# EAGLE schematic Octoprober (EAGLE 6.5.0)
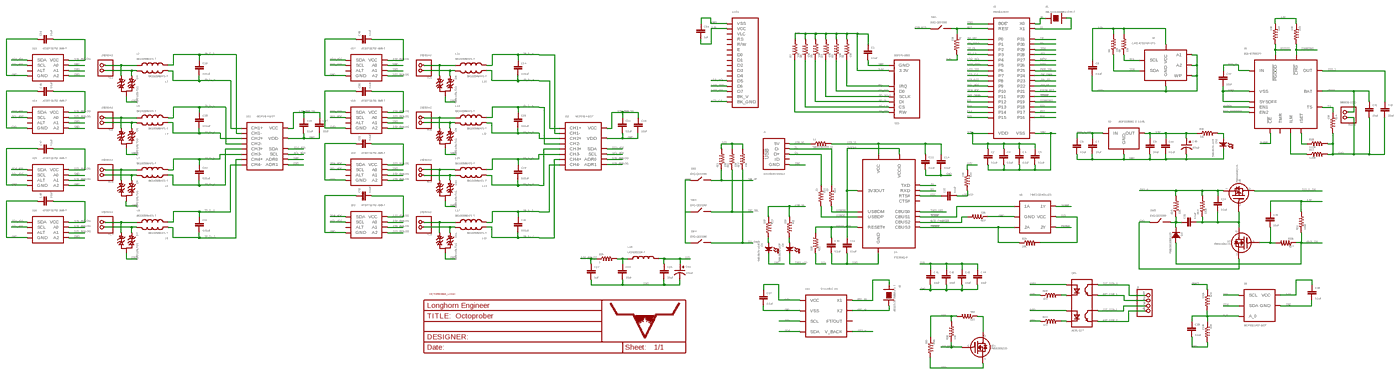
[diagram p0: schematic, sheet 1, overview]
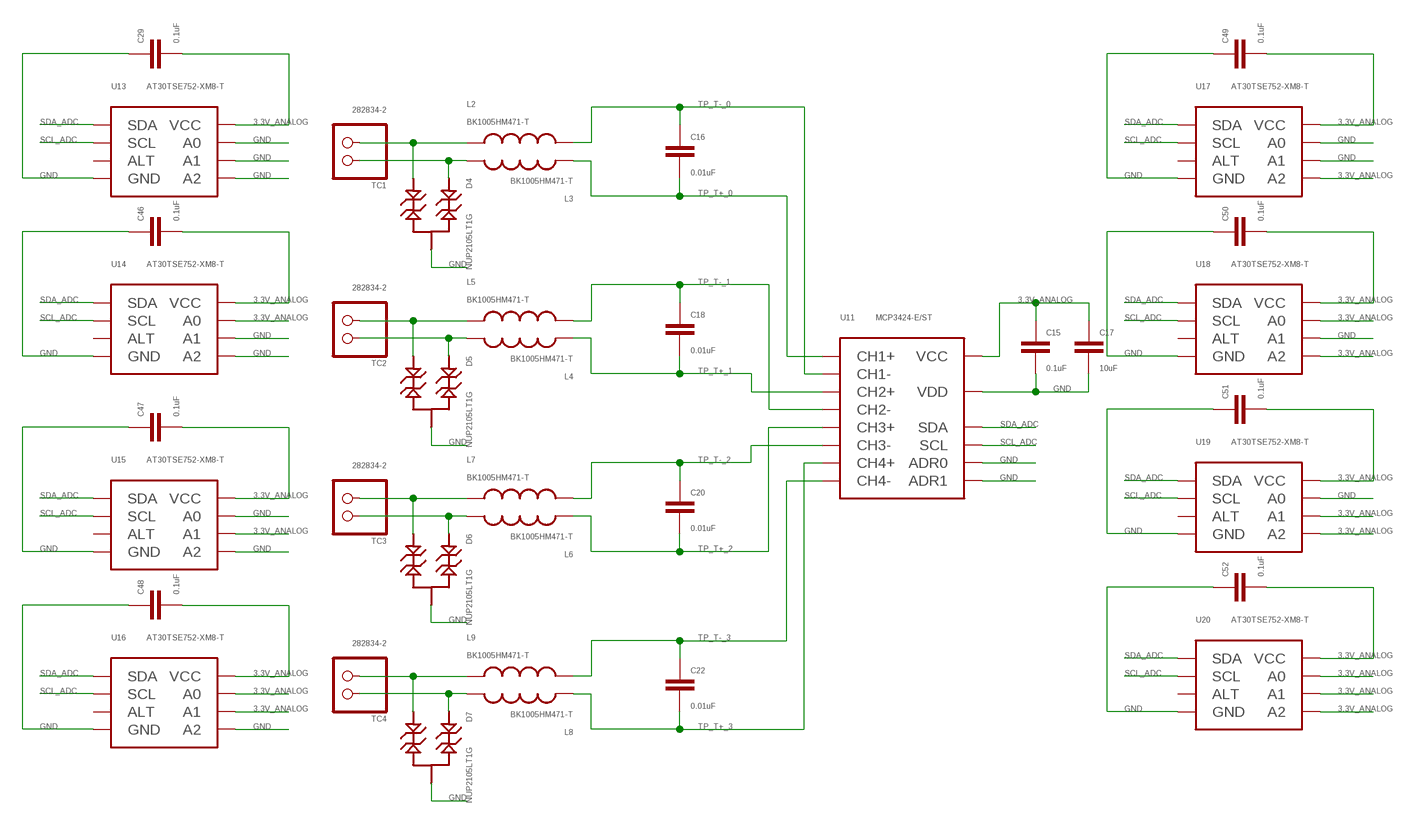
[diagram p1: schematic, sheet 1, part 1 of 4]
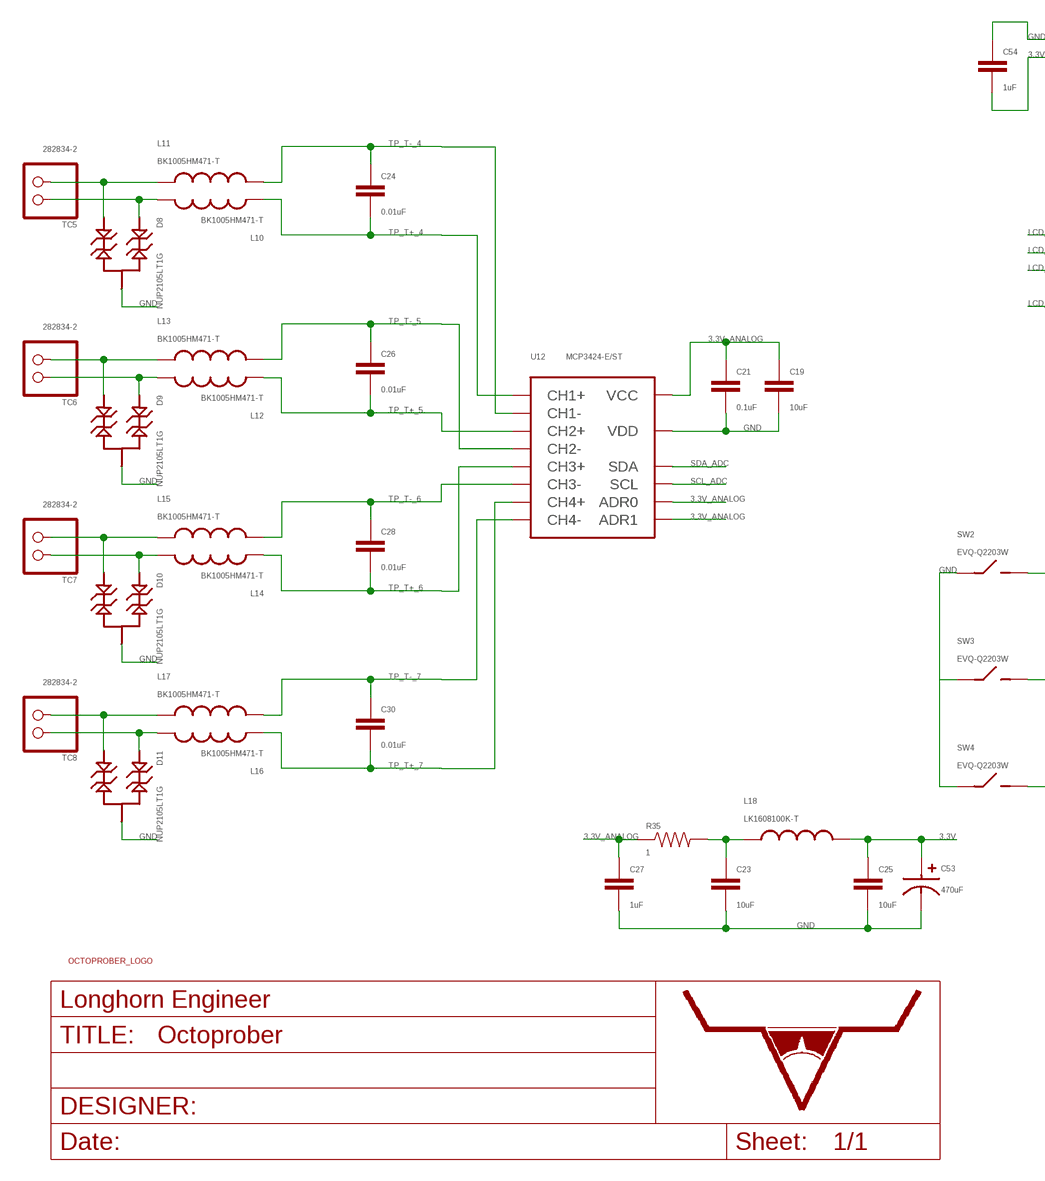
[diagram p2: schematic, sheet 1, part 2 of 4]
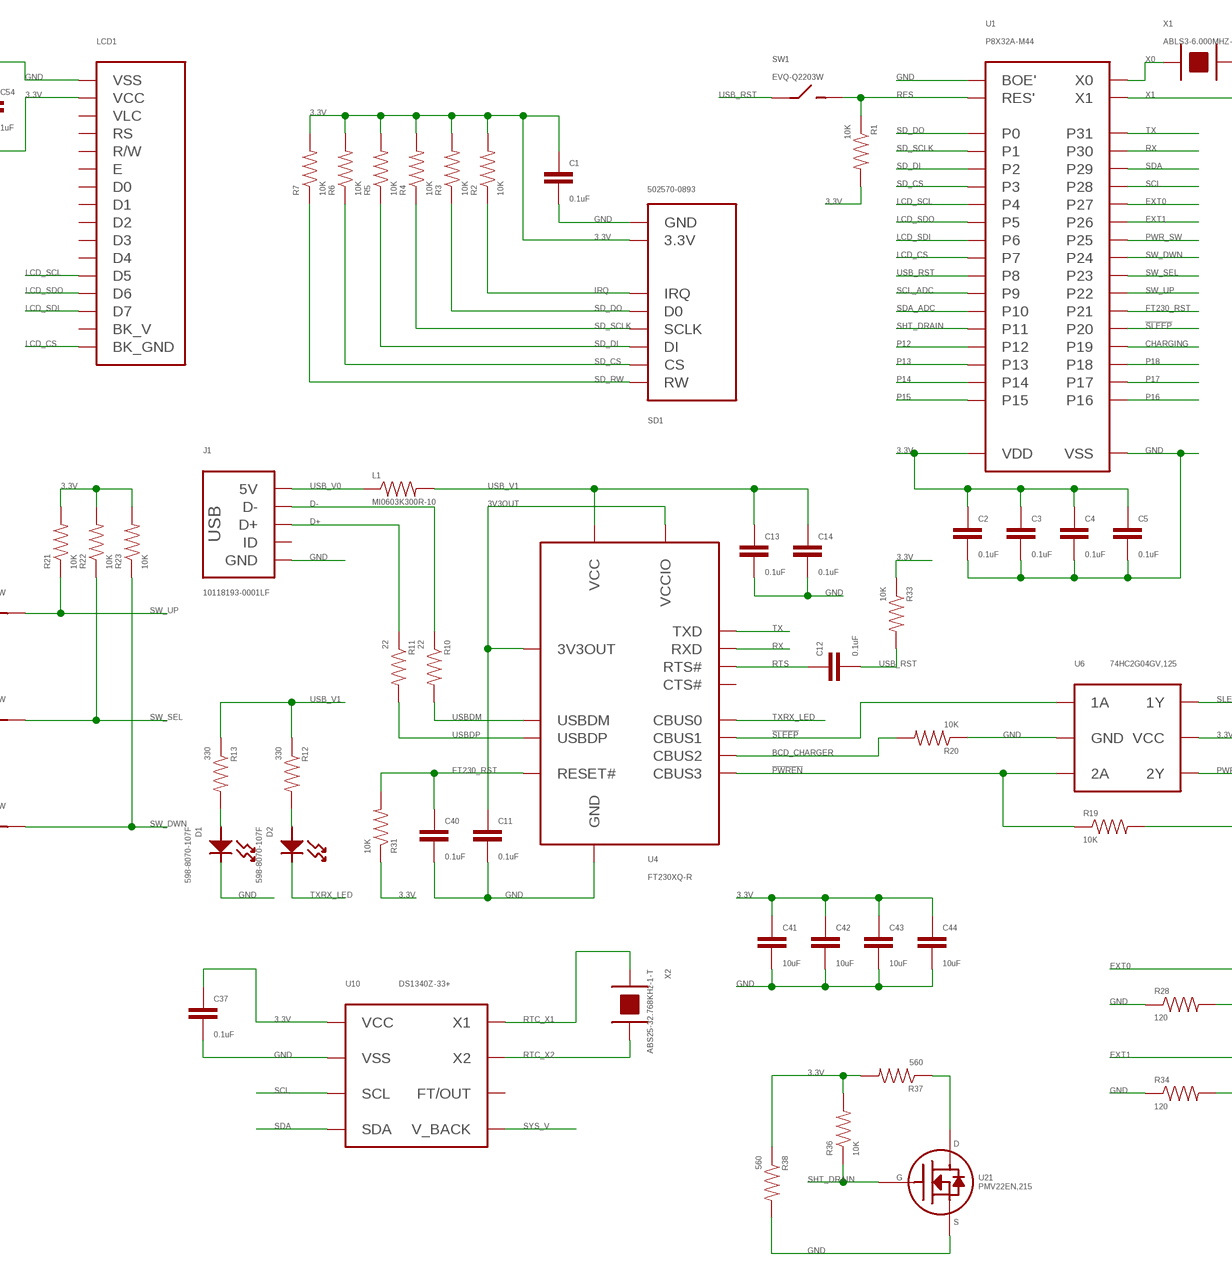
[diagram p3: schematic, sheet 1, part 3 of 4]
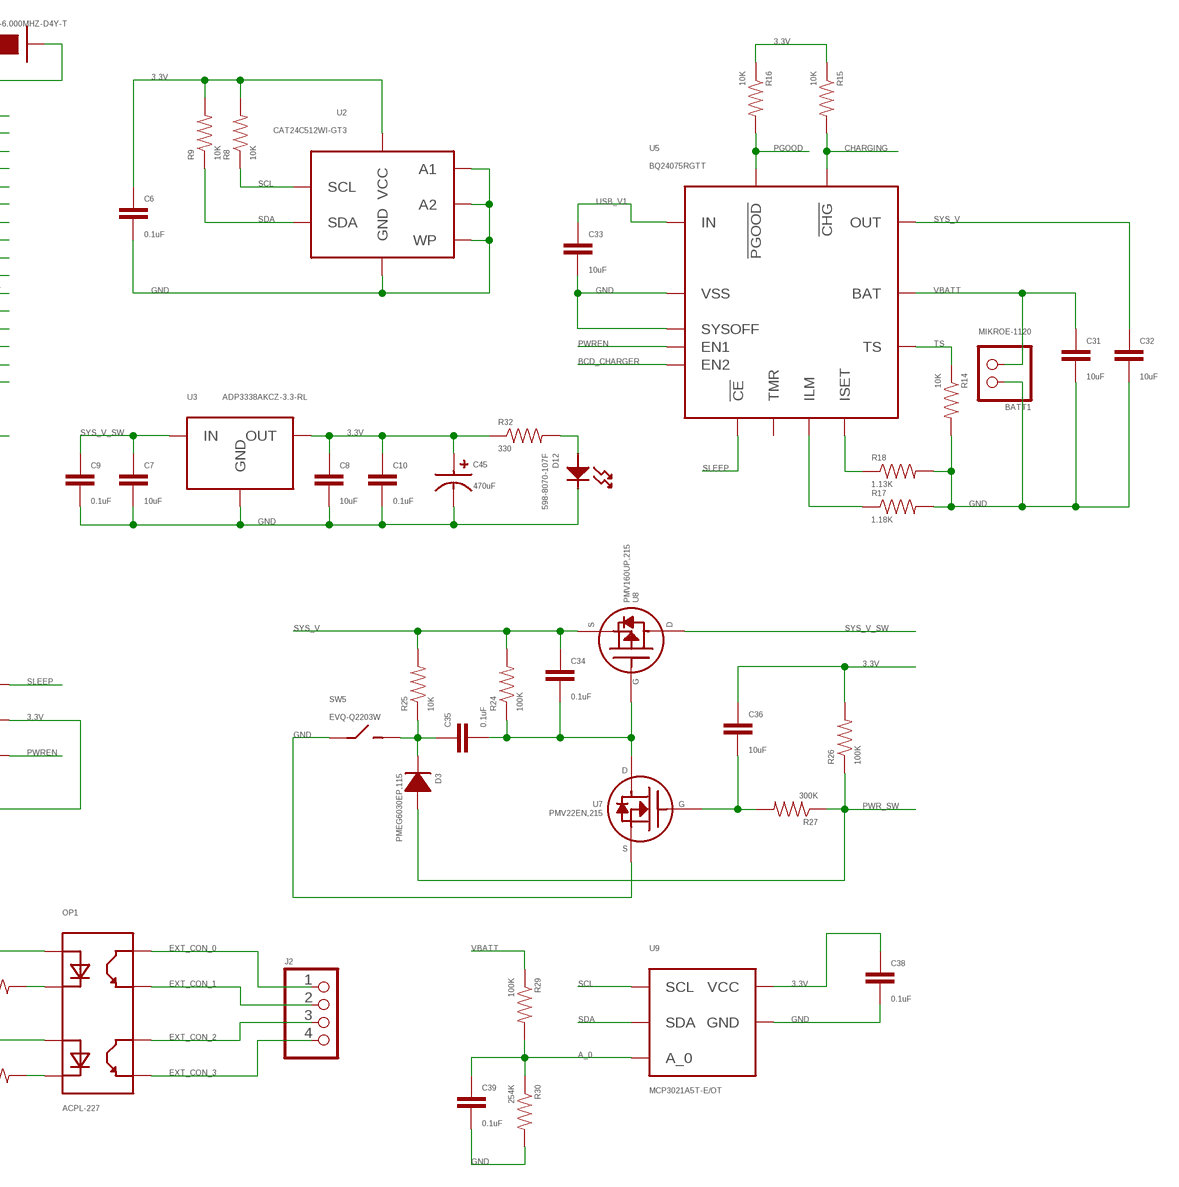
[diagram p4: schematic, sheet 1, part 4 of 4]

## Parts
BATT1  MIKROE-1120  PH_1X02HEADER_PTH  [HEADER_01X02_PTH]
C1  0.1uF  CAPACITOR_NON_POLAR0402  [0402]
C2  0.1uF  CAPACITOR_NON_POLAR0402  [0402]
C3  0.1uF  CAPACITOR_NON_POLAR0402  [0402]
C4  0.1uF  CAPACITOR_NON_POLAR0402  [0402]
C5  0.1uF  CAPACITOR_NON_POLAR0402  [0402]
C6  0.1uF  CAPACITOR_NON_POLAR0402  [0402]
C7  10uF  CAPACITOR_NON_POLAR1206  [1206]
C8  10uF  CAPACITOR_NON_POLAR1206  [1206]
C9  0.1uF  CAPACITOR_NON_POLAR0402  [0402]
C10  0.1uF  CAPACITOR_NON_POLAR0402  [0402]
C11  0.1uF  CAPACITOR_NON_POLAR0402  [0402]
C12  0.1uF  CAPACITOR_NON_POLAR0402  [0402]
C13  0.1uF  CAPACITOR_NON_POLAR0402  [0402]
C14  0.1uF  CAPACITOR_NON_POLAR0402  [0402]
C15  0.1uF  CAPACITOR_NON_POLAR0402  [0402]
C16  0.01uF  CAPACITOR_NON_POLAR0402  [0402]
C17  10uF  CAPACITOR_NON_POLAR0402  [0402]
C18  0.01uF  CAPACITOR_NON_POLAR0402  [0402]
C19  10uF  CAPACITOR_NON_POLAR0402  [0402]
C20  0.01uF  CAPACITOR_NON_POLAR0402  [0402]
C21  0.1uF  CAPACITOR_NON_POLAR0402  [0402]
C22  0.01uF  CAPACITOR_NON_POLAR0402  [0402]
C23  10uF  CAPACITOR_NON_POLAR0402  [0402]
C24  0.01uF  CAPACITOR_NON_POLAR0402  [0402]
C25  10uF  CAPACITOR_NON_POLAR0402  [0402]
C26  0.01uF  CAPACITOR_NON_POLAR0402  [0402]
C27  1uF  CAPACITOR_NON_POLAR0402  [0402]
C28  0.01uF  CAPACITOR_NON_POLAR0402  [0402]
C29  0.1uF  CAPACITOR_NON_POLAR0402  [0402]
C30  0.01uF  CAPACITOR_NON_POLAR0402  [0402]
C31  10uF  CAPACITOR_NON_POLAR1206  [1206]
C32  10uF  CAPACITOR_NON_POLAR1206  [1206]
C33  10uF  CAPACITOR_NON_POLAR1206  [1206]
C34  0.1uF  CAPACITOR_NON_POLAR0402  [0402]
C35  0.1uF  CAPACITOR_NON_POLAR0402  [0402]
C36  10uF  CAPACITOR_NON_POLAR1206  [1206]
C37  0.1uF  CAPACITOR_NON_POLAR0402  [0402]
C38  0.1uF  CAPACITOR_NON_POLAR0402  [0402]
C39  0.1uF  CAPACITOR_NON_POLAR0402  [0402]
C40  0.1uF  CAPACITOR_NON_POLAR0402  [0402]
C41  10uF  CAPACITOR_NON_POLAR0402  [0402]
C42  10uF  CAPACITOR_NON_POLAR0402  [0402]
C43  10uF  CAPACITOR_NON_POLAR0402  [0402]
C44  10uF  CAPACITOR_NON_POLAR0402  [0402]
C45  470uF  CAPACITOR_POLARIZEDCASE_D  [CASE_D]
C46  0.1uF  CAPACITOR_NON_POLAR0402  [0402]
C47  0.1uF  CAPACITOR_NON_POLAR0402  [0402]
C48  0.1uF  CAPACITOR_NON_POLAR0402  [0402]
C49  0.1uF  CAPACITOR_NON_POLAR0402  [0402]
C50  0.1uF  CAPACITOR_NON_POLAR0402  [0402]
C51  0.1uF  CAPACITOR_NON_POLAR0402  [0402]
C52  0.1uF  CAPACITOR_NON_POLAR0402  [0402]
C53  470uF  CAPACITOR_POLARIZEDCASE_D  [CASE_D]
C54  1uF  CAPACITOR_NON_POLAR0402  [0402]
D1  598-8070-107F  LED_SINGLE0402  [LED_0402]
D2  598-8070-107F  LED_SINGLE0402  [LED_0402]
D3  PMEG6030EP,115  DIODESOD-128  [SOD-128]
D4  NUP2105LT1G  TVS_DIODE_DUALSOT-23  [SOT-23]
D5  NUP2105LT1G  TVS_DIODE_DUALSOT-23  [SOT-23]
D6  NUP2105LT1G  TVS_DIODE_DUALSOT-23  [SOT-23]
D7  NUP2105LT1G  TVS_DIODE_DUALSOT-23  [SOT-23]
D8  NUP2105LT1G  TVS_DIODE_DUALSOT-23  [SOT-23]
D9  NUP2105LT1G  TVS_DIODE_DUALSOT-23  [SOT-23]
D10  NUP2105LT1G  TVS_DIODE_DUALSOT-23  [SOT-23]
D11  NUP2105LT1G  TVS_DIODE_DUALSOT-23  [SOT-23]
D12  598-8070-107F  LED_SINGLE0402  [LED_0402]
J1  10118193-0001LF  USB10118193-0001LF  [10118193-0001LF]
J2  PH_1X04HEADER_PTH  [HEADER_01X04_PTH]
L1  MI0603K300R-10  RESISTOR0603  [0603]
L2  BK1005HM471-T  INDUCTOR0402  [0402]
L3  BK1005HM471-T  INDUCTOR0402  [0402]
L4  BK1005HM471-T  INDUCTOR0402  [0402]
L5  BK1005HM471-T  INDUCTOR0402  [0402]
L6  BK1005HM471-T  INDUCTOR0402  [0402]
L7  BK1005HM471-T  INDUCTOR0402  [0402]
L8  BK1005HM471-T  INDUCTOR0402  [0402]
L9  BK1005HM471-T  INDUCTOR0402  [0402]
L10  BK1005HM471-T  INDUCTOR0402  [0402]
L11  BK1005HM471-T  INDUCTOR0402  [0402]
L12  BK1005HM471-T  INDUCTOR0402  [0402]
L13  BK1005HM471-T  INDUCTOR0402  [0402]
L14  BK1005HM471-T  INDUCTOR0402  [0402]
L15  BK1005HM471-T  INDUCTOR0402  [0402]
L16  BK1005HM471-T  INDUCTOR0402  [0402]
L17  BK1005HM471-T  INDUCTOR0402  [0402]
L18  LK1608100K-T  INDUCTOR0603  [0603]
LCD1  HD44780_LCD1602_COUNTERSINK  [CHAR_DISPLAY_1602_COUNTERSINK]
OP1  ACPL-227  ACPL-227SOIC-8  [SOIC-8]
R1  10K  RESISTOR0402  [0402]
R2  10K  RESISTOR0402  [0402]
R3  10K  RESISTOR0402  [0402]
R4  10K  RESISTOR0402  [0402]
R5  10K  RESISTOR0402  [0402]
R6  10K  RESISTOR0402  [0402]
R7  10K  RESISTOR0402  [0402]
R8  10K  RESISTOR0402  [0402]
R9  10K  RESISTOR0402  [0402]
R10  22  RESISTOR0402  [0402]
R11  22  RESISTOR0402  [0402]
R12  330  RESISTOR0402  [0402]
R13  330  RESISTOR0402  [0402]
R14  10K  RESISTOR0402  [0402]
R15  10K  RESISTOR0402  [0402]
R16  10K  RESISTOR0402  [0402]
R17  1.18K  RESISTOR0402  [0402]
R18  1.13K  RESISTOR0402  [0402]
R19  10K  RESISTOR0402  [0402]
R20  10K  RESISTOR0402  [0402]
R21  10K  RESISTOR0402  [0402]
R22  10K  RESISTOR0402  [0402]
R23  10K  RESISTOR0402  [0402]
R24  100K  RESISTOR0402  [0402]
R25  10K  RESISTOR0402  [0402]
R26  100K  RESISTOR0402  [0402]
R27  300K  RESISTOR0402  [0402]
R28  120  RESISTOR0402  [0402]
R29  100K  RESISTOR0402  [0402]
R30  254K  RESISTOR0402  [0402]
R31  10K  RESISTOR0402  [0402]
R32  330  RESISTOR0402  [0402]
R33  10K  RESISTOR0402  [0402]
R34  120  RESISTOR0402  [0402]
R35  1  RESISTOR0402  [0402]
R36  10K  RESISTOR0402  [0402]
R37  560  RESISTOR0402  [0402]
R38  560  RESISTOR0402  [0402]
SD1  502570-0893  SD_CARD502570-0893  [502570-0893]
SW1  EVQ-Q2203W  SPSTEVQ-Q2203W  [EVQ-Q2203W]
SW2  EVQ-Q2203W  SPSTEVQ-Q2203W  [EVQ-Q2203W]
SW3  EVQ-Q2203W  SPSTEVQ-Q2203W  [EVQ-Q2203W]
SW4  EVQ-Q2203W  SPSTEVQ-Q2203W  [EVQ-Q2203W]
SW5  EVQ-Q2203W  SPSTEVQ-Q2203W  [EVQ-Q2203W]
TC1  282834-2  PH_1X02SCREW_TERM  [HEADER_01X02_PTH_SCREWTERM]
TC2  282834-2  PH_1X02SCREW_TERM  [HEADER_01X02_PTH_SCREWTERM]
TC3  282834-2  PH_1X02SCREW_TERM  [HEADER_01X02_PTH_SCREWTERM]
TC4  282834-2  PH_1X02SCREW_TERM  [HEADER_01X02_PTH_SCREWTERM]
TC5  282834-2  PH_1X02SCREW_TERM  [HEADER_01X02_PTH_SCREWTERM]
TC6  282834-2  PH_1X02SCREW_TERM  [HEADER_01X02_PTH_SCREWTERM]
TC7  282834-2  PH_1X02SCREW_TERM  [HEADER_01X02_PTH_SCREWTERM]
TC8  282834-2  PH_1X02SCREW_TERM  [HEADER_01X02_PTH_SCREWTERM]
U1  P8X32A-M44  P8X32A_PROPELLERQFN-44  [QFN-44]
U2  CAT24C512WI-GT3  CAT24M01XI-T2SOIC-8_W  [SOIC-8_W]
U3  ADP3338AKCZ-3.3-RL  FIXED_VOLTAGE_REGSOT-223_ALT  [SOT-223]
U4  FT230XQ-R  FT230XQFN-16  [QFN-16]
U5  BQ24075RGTT  BQ2407XQFN-16  [QFN-16_BOT_PAD]
U6  74HC2G04GV,125  74HCT2G04GV,125TTSOP-6  [TTSOP-6]
U7  PMV22EN,215  MOSFET_N-CHANNEL_SINGLESOT-23  [SOT-23]
U8  PMV160UP,215  MOSFET_P-CHANNEL_SINGLESOT-23  [SOT-23]
U9  MCP3021A5T-E/OT  MCP3021SOT-23A  [SOT-23A]
U10  DS1340Z-33+  DS1340SOIC-8  [SOIC-8]
U11  MCP3424-E/ST  MCP3424TTSOP-14  [TTSOP-14]
U12  MCP3424-E/ST  MCP3424TTSOP-14  [TTSOP-14]
U13  AT30TSE752-XM8-T  AT30TSEXXXMSOP-8  [MSOP-8]
U14  AT30TSE752-XM8-T  AT30TSEXXXMSOP-8  [MSOP-8]
U15  AT30TSE752-XM8-T  AT30TSEXXXMSOP-8  [MSOP-8]
U16  AT30TSE752-XM8-T  AT30TSEXXXMSOP-8  [MSOP-8]
U17  AT30TSE752-XM8-T  AT30TSEXXXMSOP-8  [MSOP-8]
U18  AT30TSE752-XM8-T  AT30TSEXXXMSOP-8  [MSOP-8]
U19  AT30TSE752-XM8-T  AT30TSEXXXMSOP-8  [MSOP-8]
U20  AT30TSE752-XM8-T  AT30TSEXXXMSOP-8  [MSOP-8]
U21  PMV22EN,215  MOSFET_N-CHANNEL_SINGLESOT-23  [SOT-23]
U$1  LHE_FRAME  [LHE_FRAME]
U$2  OCTOPROBER_LOGONORMAL  [OCTOPROBER_LOGO]
X1  ABLS3-6.000MHZ-D4Y-T  CRYSTALHC-49  [HC-49/US_SM]
X2  ABS25-32.768KHz-1-T  CRYSTAL8MM_X_3.8MM  [8MM_X_3.8MM]

## Nets
3.3V: C1.1 C2.1 C3.1 C4.1 C5.1 C6.1 C8.1 C10.1 C25.1 C36.1 C37.1 C38.1 C41.1 C42.1 C43.1 C44.1 C45.P(POS) C53.P(POS) C54.2 L18.2 LCD1.2(VCC) R1.2 R2.2 R3.2 R4.2 R5.2 R6.2 R7.2 R8.2 R9.2 R15.1 R16.1 R19.2 R21.2 R22.2 R23.2 R26.2 R31.1 R32.1 R33.1 R36.2 R37.2 R38.1 SD1.5(3.3V) U1.8(VDD) U1.18(VDD) U1.30(VDD) U1.40(VDD) U2.8(VCC) U3.COM1(OUT) U3.COM2(OUT) U6.5(VCC) U9.1(VCC) U10.8(VCC)
3.3V_ANALOG: C15.1 C17.1 C19.1 C21.1 C27.1 C29.2 C46.2 C47.2 C48.2 C49.2 C50.2 C51.2 C52.2 R35.1 U11.5(VCC) U12.5(VCC) U12.9(ADR0) U12.10(ADR1) U13.P$8(VCC) U14.P$7(A0) U14.P$8(VCC) U15.P$6(A1) U15.P$8(VCC) U16.P$6(A1) U16.P$7(A0) U16.P$8(VCC) U17.P$5(A2) U17.P$8(VCC) U18.P$5(A2) U18.P$7(A0) U18.P$8(VCC) U19.P$5(A2) U19.P$6(A1) U19.P$8(VCC) U20.P$5(A2) U20.P$6(A1) U20.P$7(A0) U20.P$8(VCC)
3V3OUT: C11.1 U4.1(VCCIO) U4.8(3V3OUT)
!PWREN: R19.1 U4.14(CBUS3) U6.3(2A)
!SLEEP: U1.23(P20) U4.11(CBUS1) U6.1(1A)
A_0: C39.1 R29.2 R30.1 U9.3(A_0)
BCD_CHARGER: R20.2 U4.5(CBUS2) U5.5(EN2)
CHARGING: R15.2 U1.22(P19) U5.9(!CHG)
D+: J1.3(D+) R11.1
D-: J1.2(D-) R10.1
EXT0: OP1.1 U1.34(P27)
EXT1: OP1.3 U1.33(P26)
EXT_CON_0: J2.1 OP1.8
EXT_CON_1: J2.2 OP1.7
EXT_CON_2: J2.3 OP1.6
EXT_CON_3: J2.4 OP1.5
FT230_RST: C40.1 R31.2 U1.24(P21) U4.9(RESET#)
GND: BATT1.1 C1.2 C2.2 C3.2 C4.2 C5.2 C6.2 C7.2 C8.2 C9.2 C10.2 C11.2 C13.2 C14.2 C15.2 C17.2 C19.2 C21.2 C23.2 C25.2 C27.2 C29.1 C31.2 C32.2 C33.2 C37.2 C38.2 C39.2 C40.2 C41.2 C42.2 C43.2 C44.2 C45.N(NEG) C46.1 C47.1 C48.1 C49.1 C50.1 C51.1 C52.1 C53.N(NEG) C54.1 D1.CATHODE D4.3 D5.3 D6.3 D7.3 D8.3 D9.3 D10.3 D11.3 D12.CATHODE J1.5(GND) J1.S1(GND) J1.S2(GND) J1.S3(GND) J1.S4(GND) LCD1.1(VSS) R14.2 R17.2 R18.2 R20.1 R28.1 R30.2 R34.1 R38.2 SD1.3(GND) SD1.SHIELD0(GND) SD1.SHIELD1(GND) SD1.SHIELD2(GND) SD1.SHIELD3(GND) SW2.1(A) SW2.2(A) SW3.1(A) SW3.2(A) SW4.1(A) SW4.2(A) SW5.1(A) SW5.2(A) U1.5(VSS) U1.6(BOE') U1.17(VSS) U1.27(VSS) U1.39(VSS) U2.2(A1) U2.3(A2) U2.4(GND) U2.7(WP) U3.IN(GND) U4.3(GND) U4.13(GND) U4.PAD(GND) U5.8(VSS) U5.15(SYSOFF) U5.PAD0(VSS) U5.PAD1(VSS) U6.2(GND) U7.2(SOURCE) U9.2(GND) U10.4(VSS) U11.6(VDD) U11.9(ADR0) U11.10(ADR1) U12.6(VDD) U13.P$4(GND) U13.P$5(A2) U13.P$6(A1) U13.P$7(A0) U14.P$4(GND) U14.P$5(A2) U14.P$6(A1) U15.P$4(GND) U15.P$5(A2) U15.P$7(A0) U16.P$4(GND) U16.P$5(A2) U17.P$4(GND) U17.P$6(A1) U17.P$7(A0) U18.P$4(GND) U18.P$6(A1) U19.P$4(GND) U19.P$7(A0) U20.P$4(GND) U21.2(SOURCE)
ILM: R17.1 U5.12(ILM)
IRQ: R2.1 SD1.1(IRQ)
ISET: R18.1 U5.16(ISET)
LCD_CS: LCD1.16(BK_GND) U1.4(P7)
LCD_SCL: LCD1.12(D5) U1.1(P4)
LCD_SDI: LCD1.14(D7) U1.3(P6)
LCD_SDO: LCD1.13(D6) U1.2(P5)
N$1: D2.ANODE R12.2
N$2: D4.2 L2.1 TC1.2
N$3: D1.ANODE R13.2
N$4: C35.1 D3.CATHODE R25.1 SW5.3(B) SW5.4(B)
N$5: C36.2 R27.2 U7.1(GATE)
N$6: OP1.2 R28.2
N$7: D4.1 L3.2 TC1.1
N$8: D5.2 L5.1 TC2.2
N$9: D5.1 L4.2 TC2.1
N$10: D6.2 L7.1 TC3.2
N$11: D6.1 L6.2 TC3.1
N$12: D7.2 L9.1 TC4.2
N$13: D7.1 L8.2 TC4.1
N$14: D11.2 L17.1 TC8.2
N$15: D11.1 L16.2 TC8.1
N$16: D10.2 L15.1 TC7.2
N$17: D10.1 L14.2 TC7.1
N$18: D9.2 L13.1 TC6.2
N$19: D9.1 L12.2 TC6.1
N$20: D8.2 L11.1 TC5.2
N$21: D8.1 L10.2 TC5.1
N$22: D12.ANODE R32.2
N$24: OP1.4 R34.2
N$25: C23.1 L18.1 R35.2
N$28: R37.1 U21.3(DRAIN)
P12: U1.13(P12)
P13: U1.14(P13)
P14: U1.15(P14)
P15: U1.16(P15)
P16: U1.19(P16)
P17: U1.20(P17)
P18: U1.21(P18)
PGOOD: R16.2 U5.7(!PGOOD)
PWR_SW: D3.ANODE R26.1 R27.1 U1.32(P25)
PWREN: U5.6(EN1) U6.4(2Y)
RES: R1.1 SW1.3(B) SW1.4(B) U1.7(RES')
RTC_X1: U10.1(X1) X2.1
RTC_X2: U10.2(X2) X2.4
RTS: C12.1 U4.16(RTS#)
RX: U1.37(P30) U4.2(RXD)
S_P_G: C34.2 C35.2 R24.1 U7.3(DRAIN) U8.1(GATE)
SCL: R8.1 U1.35(P28) U2.6(SCL) U9.5(SCL) U10.6(SCL)
SCL_ADC: U1.10(P9) U11.8(SCL) U12.8(SCL) U13.P$2(SCL) U14.P$2(SCL) U15.P$2(SCL) U16.P$2(SCL) U17.P$2(SCL) U18.P$2(SCL) U19.P$2(SCL) U20.P$2(SCL)
SD_CS: R6.1 SD1.7(CS) U1.44(P3)
SD_DI: R5.1 SD1.6(DI) U1.43(P2)
SD_DO: R3.1 SD1.2(D0) U1.41(P0)
SD_RW: R7.1 SD1.8(RW)
SD_SCLK: R4.1 SD1.4(SCLK) U1.42(P1)
SDA: R9.1 U1.36(P29) U2.5(SDA) U9.4(SDA) U10.5(SDA)
SDA_ADC: U1.11(P10) U11.7(SDA) U12.7(SDA) U13.P$1(SDA) U14.P$1(SDA) U15.P$1(SDA) U16.P$1(SDA) U17.P$1(SDA) U18.P$1(SDA) U19.P$1(SDA) U20.P$1(SDA)
SHT_DRAIN: R36.1 U1.12(P11) U21.1(GATE)
SLEEP: U5.4(!CE) U6.6(1Y)
SW_DWN: R23.1 SW4.3(B) SW4.4(B) U1.31(P24)
SW_SEL: R22.1 SW3.3(B) SW3.4(B) U1.26(P23)
SW_UP: R21.1 SW2.3(B) SW2.4(B) U1.25(P22)
SYS_V: C32.1 C34.1 R24.2 R25.2 U5.10(OUT) U5.11(OUT) U8.2(SOURCE) U10.3(V_BACK)
SYS_V_SW: C7.1 C9.1 U3.OUT(IN) U8.3(DRAIN)
TP_T+_0: C16.2 L3.1 U11.1(CH1+)
TP_T+_1: C18.2 L4.1 U11.3(CH2+)
TP_T+_2: C20.2 L6.1 U11.11(CH3+)
TP_T+_3: C22.2 L8.1 U11.13(CH4+)
TP_T+_4: C24.2 L10.1 U12.1(CH1+)
TP_T+_5: C26.2 L12.1 U12.3(CH2+)
TP_T+_6: C28.2 L14.1 U12.11(CH3+)
TP_T+_7: C30.2 L16.1 U12.13(CH4+)
TP_T-_0: C16.1 L2.2 U11.2(CH1-)
TP_T-_1: C18.1 L5.2 U11.4(CH2-)
TP_T-_2: C20.1 L7.2 U11.12(CH3-)
TP_T-_3: C22.1 L9.2 U11.14(CH4-)
TP_T-_4: C24.1 L11.2 U12.2(CH1-)
TP_T-_5: C26.1 L13.2 U12.4(CH2-)
TP_T-_6: C28.1 L15.2 U12.12(CH3-)
TP_T-_7: C30.1 L17.2 U12.14(CH4-)
TS: R14.1 U5.1(TS)
TX: U1.38(P31) U4.15(TXD)
TXRX_LED: D2.CATHODE U4.12(CBUS0)
USB_RST: C12.2 R33.2 SW1.1(A) SW1.2(A) U1.9(P8)
USB_V0: J1.1(5V) L1.1
USB_V1: C13.1 C14.1 C33.1 L1.2 R12.1 R13.1 U4.10(VCC) U5.13(IN)
USBDM: R10.2 U4.7(USBDM)
USBDP: R11.2 U4.6(USBDP)
VBATT: BATT1.2 C31.1 R29.1 U5.2(BAT) U5.3(BAT)
X0: U1.29(X0) X1.P$1
X1: U1.28(X1) X1.P$2
Unconnected: J1.4(ID) LCD1.3(VLC) LCD1.4(RS) LCD1.5(R/W) LCD1.6(E) LCD1.7(D0) LCD1.8(D1) LCD1.9(D2) LCD1.10(D3) LCD1.11(D4) LCD1.15(BK_V) U4.4(CTS#) U5.14(TMR) U10.7(FT/OUT) U13.P$3(ALT) U14.P$3(ALT) U15.P$3(ALT) U16.P$3(ALT) U17.P$3(ALT) U18.P$3(ALT) U19.P$3(ALT) U20.P$3(ALT)

## Library data of the parts
BATT1 TC1-TC8 = PP_Connectors:PH_1X02: 2 pin connectors
C1-C44 C46-C52 C54 = PP_Passives:CAPACITOR_NON_POLAR: Capacitor Non Polarized
C45 C53 = PP_Passives:CAPACITOR_POLARIZED: Polarized capacitors
D1 D2 D12 = PP_LED:LED_SINGLE
D3 = PP_Passives:DIODE: Diode - Single
D4-D11 = PP_Passives:TVS_DIODE_DUAL
J1 = PP_Connectors:USB
J2 = PP_Connectors:PH_1X04: 4 Pin Connectors
L1 R1-R38 = PP_Passives:RESISTOR: Resistors
L2-L18 = PP_Passives:INDUCTOR: Inductors
LCD1 = PP_Displays:HD44780_LCD
OP1 = PP_DigitalIC:ACPL-227
SD1 = PP_Connectors:SD_CARD
SW1-SW5 = PP_Electromechanical:SPST: SPST Switches
U1 = PP_DigitalIC:P8X32A_PROPELLER
U2 = PP_DigitalIC:CAT24M01XI-T2
U3 = PP_PowerIC:FIXED_VOLTAGE_REG
U4 = PP_DigitalIC:FT230X: Manufacturer Part #: FT230XS-R Manufacturer: FTDI Description: USB Interface IC USB to Basic Serial UART IC SSOP-16
U5 = PP_PowerIC:BQ2407X
U6 = PP_DigitalIC:74HCT2G04GV,125
U7 U21 = PP_DiscreteSemi:MOSFET_N-CHANNEL_SINGLE: Mosfet - N-Channel - Single
U8 = PP_DiscreteSemi:MOSFET_P-CHANNEL_SINGLE
U9 = PP_DigitalIC:MCP3021
U10 = PP_DigitalIC:DS1340
U11 U12 = PP_DigitalIC:MCP3424
U13-U20 = PP_DigitalIC:AT30TSEXXX
U$1 = PP_Aesthetics:LHE_FRAME; DNAME: Parker Dillmann; REVNUM: REV 2
U$2 = PP_Aesthetics:OCTOPROBER_LOGO
X1 X2 = PP_FreqCtrl:CRYSTAL